# EAGLE schematic EtchSketch (EAGLE 9.6.2)
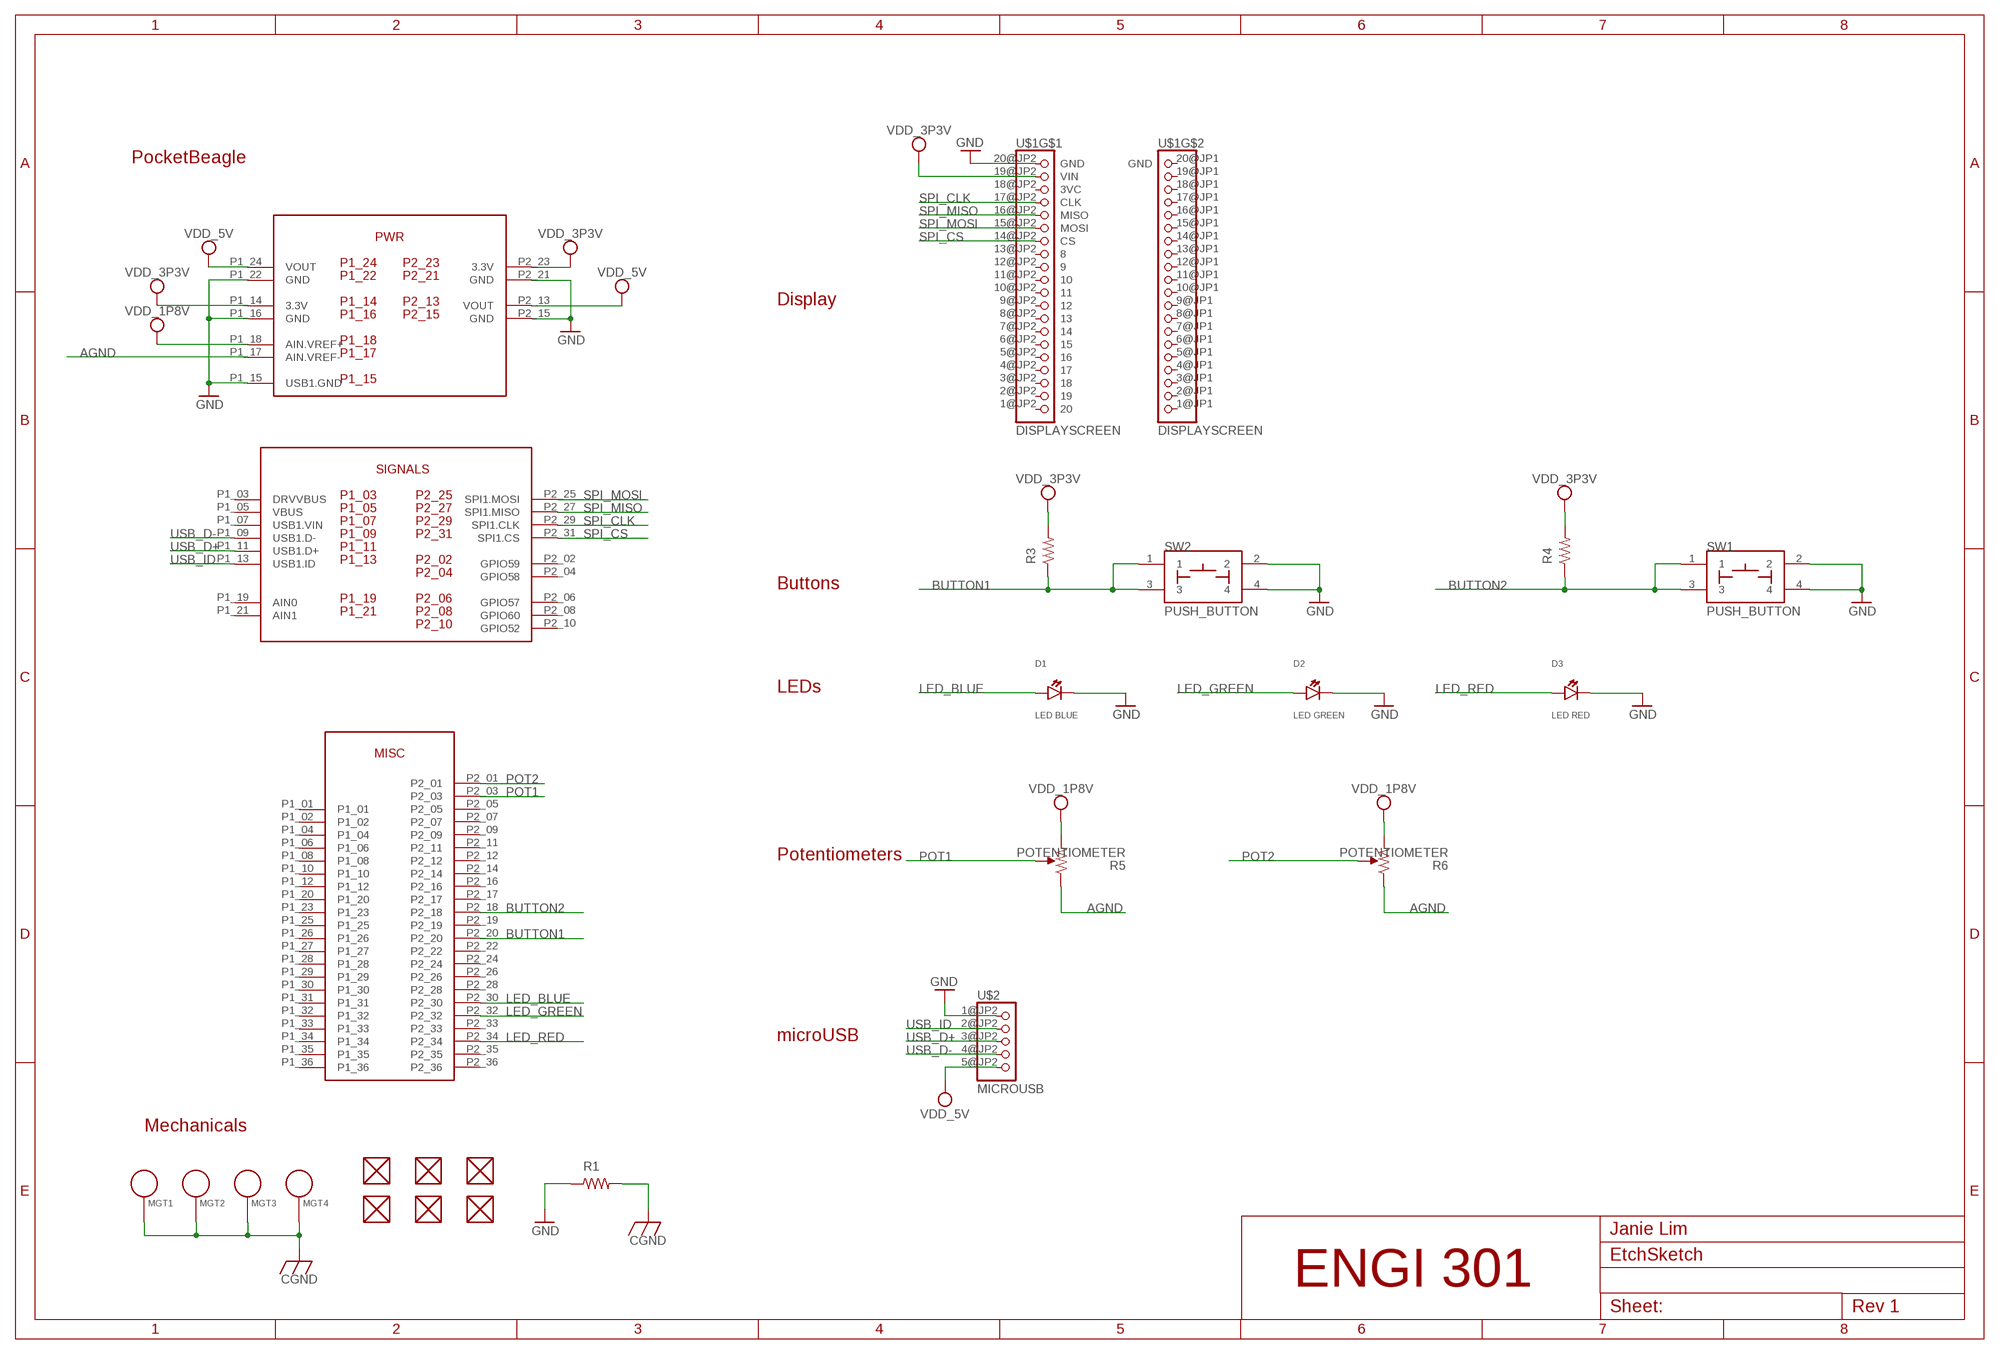
[diagram p0: schematic, sheet 1]

## Parts
D1  LED BLUE  LED  [EIA-STD]
D2  LED GREEN  LED  [EIA-STD]
D3  LED RED  LED  [EIA-STD]
FUD1  FIDUCIAL  [FIDUCIAL_40MIL]
FUD2  FIDUCIAL  [FIDUCIAL_40MIL]
FUD3  FIDUCIAL  [FIDUCIAL_40MIL]
FUD4  FIDUCIAL  [FIDUCIAL_40MIL]
FUD5  FIDUCIAL  [FIDUCIAL_40MIL]
FUD6  FIDUCIAL  [FIDUCIAL_40MIL]
MGT1  MOUNTING_HOLE  [MOUNTING_HOLE]
MGT2  MOUNTING_HOLE  [MOUNTING_HOLE]
MGT3  MOUNTING_HOLE  [MOUNTING_HOLE]
MGT4  MOUNTING_HOLE  [MOUNTING_HOLE]
R1  R_R0603  [R0603]
R3  R_R0603  [R0603]
R4  R_R0603  [R0603]
R5  POTENTIOMETER  [POT-PO90S]
R6  POTENTIOMETER  [POT-PO90S]
SW1  PUSH_BUTTON  [BUTTON_12.5MM]
SW2  PUSH_BUTTON  [BUTTON_12.5MM]
U1  POCKETBEAGLE_NEW  [POCKETBEAGLE]
U$1  DISPLAYSCREEN  [DISPLAYSCREEN]
U$2  MICROUSB  [MICROUSB]

## Nets
AGND: R5.CCW R6.CCW U1.P1_17(AIN.VREF-)
BUTTON1: R3.1 SW2.1 SW2.3 U1.P2_20
BUTTON2: R4.1 SW1.1 SW1.3 U1.P2_18
CGND: MGT1.P$1 MGT2.P$1 MGT3.P$1 MGT4.P$1 R1.2
GND: D1.CATHODE D2.CATHODE D3.CATHODE R1.1 SW1.2 SW1.4 SW2.2 SW2.4 U1.P1_15(USB1.GND) U1.P1_16(GND) U1.P1_22(GND) U1.P2_15(GND) U1.P2_21(GND) U$1.20@JP2(GND) U$2.1@JP2(GND)
LED_BLUE: D1.ANODE U1.P2_30
LED_GREEN: D2.ANODE U1.P2_32
LED_RED: D3.ANODE U1.P2_34
POT1: R5.S U1.P2_03
POT2: R6.S U1.P2_01
SPI_CLK: U1.P2_29(SPI1.CLK) U$1.17@JP2(CLK)
SPI_CS: U1.P2_31(SPI1.CS) U$1.14@JP2(CS)
SPI_MISO: U1.P2_27(SPI1.MISO) U$1.16@JP2(MISO)
SPI_MOSI: U1.P2_25(SPI1.MOSI) U$1.15@JP2(MOSI)
USB_D+: U1.P1_11(USB1.D+) U$2.3@JP2(D+)
USB_D-: U1.P1_09(USB1.D-) U$2.4@JP2(D-)
USB_ID: U1.P1_13(USB1.ID) U$2.2@JP2(ID)
VDD_1P8V: R5.CW R6.CW U1.P1_18(AIN.VREF+)
VDD_3P3V: R3.2 R4.2 U1.P1_14(3.3V) U1.P2_23(3.3V) U$1.19@JP2(VIN)
VDD_5V: U1.P1_24(VOUT) U1.P2_13(VOUT) U$2.5@JP2(5V)
Unconnected: FUD1.P$1 FUD2.P$1 FUD3.P$1 FUD4.P$1 FUD5.P$1 FUD6.P$1 U1.P1_01 U1.P1_02 U1.P1_03(DRVVBUS) U1.P1_04 U1.P1_05(VBUS) U1.P1_06 U1.P1_07(USB1.VIN) U1.P1_08 U1.P1_10 U1.P1_12 U1.P1_19(AIN0) U1.P1_20 U1.P1_21(AIN1) U1.P1_23 U1.P1_25 U1.P1_26 U1.P1_27 U1.P1_28 U1.P1_29 U1.P1_30 U1.P1_31 U1.P1_32 U1.P1_33 U1.P1_34 U1.P1_35 U1.P1_36 U1.P2_02(GPIO59) U1.P2_04(GPIO58) U1.P2_05 U1.P2_06(GPIO57) U1.P2_07 U1.P2_08(GPIO60) U1.P2_09 U1.P2_10(GPIO52) U1.P2_11 U1.P2_12 U1.P2_14 U1.P2_16 U1.P2_17 U1.P2_19 U1.P2_22 U1.P2_24 U1.P2_26 U1.P2_28 U1.P2_33 U1.P2_35 U1.P2_36 U$1.1@JP1 U$1.1@JP2 U$1.2@JP1 U$1.2@JP2 U$1.3@JP1 U$1.3@JP2 U$1.4@JP1 U$1.4@JP2 U$1.5@JP1 U$1.5@JP2 U$1.6@JP1 U$1.6@JP2 U$1.7@JP1 U$1.7@JP2 U$1.8@JP1 U$1.8@JP2 U$1.9@JP1 U$1.9@JP2 U$1.10@JP1 U$1.10@JP2 U$1.11@JP1 U$1.11@JP2 U$1.12@JP1 U$1.12@JP2 U$1.13@JP1 U$1.13@JP2 U$1.14@JP1 U$1.15@JP1 U$1.16@JP1 U$1.17@JP1 U$1.18@JP1 U$1.18@JP2(3VC) U$1.19@JP1 U$1.20@JP1(GND)

## Notes on the sheet
- PocketBeagle
- Display
- Buttons
- LEDs
- Potentiometers
- microUSB
- Mechanicals
- Janie Lim
- ENGI 301

## Library data of the parts
D1-D3 = EtchSketch:LED: EIA-STD LED, LTST-C191TBKT
FUD1-FUD6 = EtchSketch:FIDUCIAL
MGT1-MGT4 = EtchSketch:MOUNTING_HOLE: Chassis Mounting Hole w/GND connection ability
R1 R3 R4 = EtchSketch:R_: RESISTOR, American symbol
R5 R6 = EtchSketch:POTENTIOMETER: Potentiometer - Examples: P090S-14T20BR10K (987-1277-ND)
SW1 SW2 = EtchSketch:PUSH_BUTTON
U1 = EtchSketch:POCKETBEAGLE_NEW: PocketBeagle device
U$1 = EtchSketch:DISPLAYSCREEN: displayscreen
U$2 = EtchSketch:MICROUSB: microUSB expansion